# EAGLE design netSpeed (EAGLE 6.4)
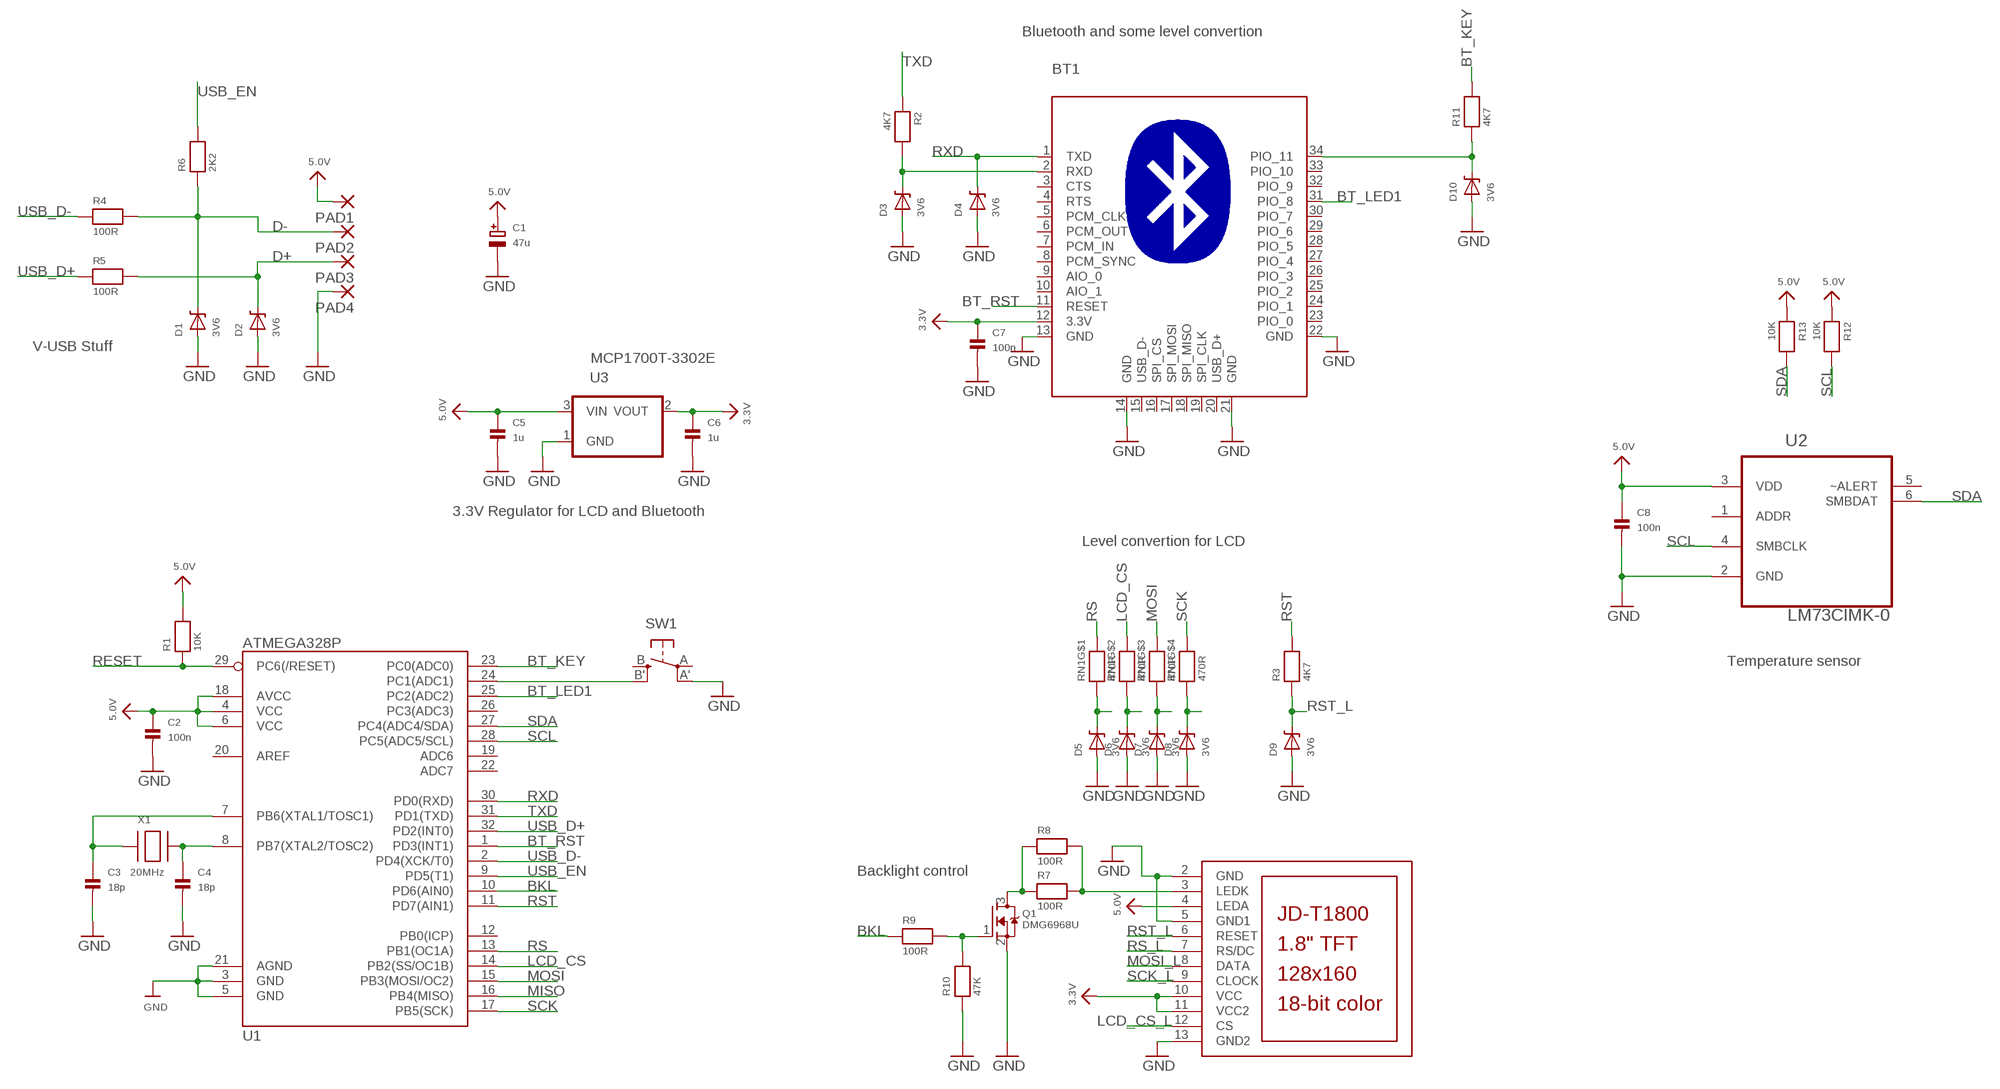
[diagram p0: schematic, sheet 1]

## Parts
BT1  BLUETOOTH_MODULE  [BLUETOOTH_MODULE]
C1  47u  CAP_ELECTROLYTICPANASONIC_C  [PANASONIC_C]
C2  100n  CAP_CERAMIC0805  [0805]
C3  18p  CAP_CERAMIC0805  [0805]
C4  18p  CAP_CERAMIC0805  [0805]
C5  1u  CAP_CERAMIC0805  [0805]
C6  1u  CAP_CERAMIC0805  [0805]
C7  100n  CAP_CERAMIC0805  [0805]
C8  100n  CAP_CERAMIC0805  [0805]
D1  3V6  DIODE-ZENERSOD-323  [SOD-323]
D2  3V6  DIODE-ZENERSOD-323  [SOD-323]
D3  3V6  DIODE-ZENERSOD-323  [SOD-323]
D4  3V6  DIODE-ZENERSOD-323  [SOD-323]
D5  3V6  DIODE-ZENERSOD-323  [SOD-323]
D6  3V6  DIODE-ZENERSOD-323  [SOD-323]
D7  3V6  DIODE-ZENERSOD-323  [SOD-323]
D8  3V6  DIODE-ZENERSOD-323  [SOD-323]
D9  3V6  DIODE-ZENERSOD-323  [SOD-323]
D10  3V6  DIODE-ZENERSOD-323  [SOD-323]
LCD1  JD-T1800  [JD-T1800]
PAD1  SMD2  [SMD1,27-2,54]
PAD2  SMD2  [SMD1,27-2,54]
PAD3  SMD2  [SMD1,27-2,54]
PAD4  SMD2  [SMD1,27-2,54]
Q1  DMG6968U  MOSFET-NWIDE  [SOT23-WIDE]
R1  10K  RESISTOR0805  [0805]
R2  4K7  RESISTOR0805  [0805]
R3  4K7  RESISTOR0805  [0805]
R4  100R  RESISTOR0805  [0805]
R5  100R  RESISTOR0805  [0805]
R6  2K2  RESISTOR0805  [0805]
R7  100R  RESISTOR0805  [0805]
R8  100R  RESISTOR0805  [0805]
R9  100R  RESISTOR0805  [0805]
R10  47K  RESISTOR0805  [0805]
R11  4K7  RESISTOR0805  [0805]
R12  10K  RESISTOR0805  [0805]
R13  10K  RESISTOR0805  [0805]
RN1  470R  RESISTOR_4PACK  [RESPACK_4X0603]
SW1  SPST_TACT  [TACT_SMD]
U1  ATMEGA328P  ATMEGA328_SMT  [TQFP32-08]
U2  LM73CIMK-0  [SOT95P285X100-6N]
U3  MCP1700T-3302E  MCP1700T-2502E/TTWIDE_PAD  [SOT-23]
X1  20MHz  XTALNX5032  [NX5032]

## Nets
3.3V: BT1.12(3.3V) C6.1 C7.1 LCD1.10(VCC) LCD1.11(VCC2) U3.2(VOUT)
5.0V: C1.+ C2.1 C5.1 C8.1 LCD1.4(LEDA) PAD1.1(P) R1.2 R12.1 R13.1 U1.4(VCC) U1.6(VCC) U1.18(AVCC) U2.3(VDD) U3.3(VIN)
BKL: R9.1 U1.10(PD6(AIN0))
BT_KEY: R11.2 U1.23(PC0(ADC0))
BT_KEY_L: BT1.34(PIO_11) D10.C R11.1
BT_LED1: BT1.31(PIO_8) U1.25(PC2(ADC2))
BT_RST: BT1.11(RESET) U1.1(PD3(INT1))
D+: D2.C PAD3.1(P) R5.2
D-: D1.C PAD2.1(P) R4.2 R6.1
GND: BT1.13(GND) BT1.14(GND) BT1.21(GND) BT1.22(GND) C1.- C2.2 C3.2 C4.2 C5.2 C6.2 C7.2 C8.2 D1.A D2.A D3.A D4.A D5.A D6.A D7.A D8.A D9.A D10.A LCD1.2(GND) LCD1.5(GND1) LCD1.13(GND2) PAD4.1(P) Q1.2(S) R10.1 SW1.A'(P1) U1.3(GND) U1.5(GND) U1.21(AGND) U2.2(GND) U3.1(GND)
LCD_CS: RN1.7 U1.14(PB2(SS/OC1B))
LCD_CS_L: D6.C LCD1.12(CS) RN1.2
MISO: U1.16(PB4(MISO))
MOSI: RN1.6 U1.15(PB3(MOSI/OC2))
MOSI_L: D7.C LCD1.8(DATA) RN1.3
N$2: SW1.B'(S1) U1.24(PC1(ADC1))
N$4: C3.1 U1.7(PB6(XTAL1/TOSC1)) X1.P$1
N$5: C4.1 U1.8(PB7(XTAL2/TOSC2)) X1.P$2
N$19: Q1.1(G) R9.2 R10.2
N$20: Q1.3(D) R7.1 R8.1
N$21: LCD1.3(LEDK) R7.2 R8.2
RESET: R1.1 U1.29(PC6(/RESET))
RS: RN1.8 U1.13(PB1(OC1A))
RS_L: D5.C LCD1.7(RS/DC) RN1.1
RST: R3.2 U1.11(PD7(AIN1))
RST_L: D9.C LCD1.6(RESET) R3.1
RXD: BT1.1(TXD) D4.C U1.30(PD0(RXD))
SCK: RN1.5 U1.17(PB5(SCK))
SCK_L: D8.C LCD1.9(CLOCK) RN1.4
SCL: R12.2 U1.28(PC5(ADC5/SCL)) U2.4(SMBCLK)
SDA: R13.2 U1.27(PC4(ADC4/SDA)) U2.6(SMBDAT)
TXD: R2.1 U1.31(PD1(TXD))
TXD_L: BT1.2(RXD) D3.C R2.2
USB_D+: R5.1 U1.32(PD2(INT0))
USB_D-: R4.1 U1.2(PD4(XCK/T0))
USB_EN: R6.2 U1.9(PD5(T1))
Unconnected: BT1.3(CTS) BT1.4(RTS) BT1.5(PCM_CLK) BT1.6(PCM_OUT) BT1.7(PCM_IN) BT1.8(PCM_SYNC) BT1.9(AIO_0) BT1.10(AIO_1) BT1.15(USB_D-) BT1.16(SPI_CS) BT1.17(SPI_MOSI) BT1.18(SPI_MISO) BT1.19(SPI_CLK) BT1.20(USB_D+) BT1.23(PIO_0) BT1.24(PIO_1) BT1.25(PIO_2) BT1.26(PIO_3) BT1.27(PIO_4) BT1.28(PIO_5) BT1.29(PIO_6) BT1.30(PIO_7) BT1.32(PIO_9) BT1.33(PIO_10) SW1.A(P) SW1.B(S) U1.12(PB0(ICP)) U1.19(ADC6) U1.20(AREF) U1.22(ADC7) U1.26(PC3(ADC3)) U2.1(ADDR) U2.5(~ALERT)

## Notes on the sheet
- Bluetooth and some level convertion
- V-USB Stuff
- 3.3V Regulator for LCD and Bluetooth
- Level convertion for LCD
- Temperature sensor
- Backlight control

## Library data of the parts
BT1 = microbuilder:BLUETOOTH_MODULE: BLUETOOTH MODULE
C1 = microbuilder:CAP_ELECTROLYTIC: Electrolytic Capacitors SMT PANASONIC_C - Size C Panasonic Electrolytic Aluminum Capacitor 47µF 16V 20% Electrolytic Capacitor [Digikey: PCE3890TR-ND] PANASONIC_D - Size D Panasonic Electrolytic Aluminum Capacitor 100µF 25V 20% Electrolytic Capacitor [Digikey: PCE3898TR-ND] PTH 3.5 mm grid, 8 mm diameter ... 3.5 mm grid, 10 mm diameter ...
C2-C8 = microbuilder:CAP_CERAMIC: Ceramic Capacitors 0402 - 0402 Surface Mount Capacitors 16pF 50V 5% [Digikey: 445-4899-2-ND] 18pF 50V 5% [Digikey: 490-1281-2-ND] 22pF 50V 5% [Digikey: 490-1283-2-ND] 68pF 50V 5% [Digikey: 490-1289-2-ND] 0.1uF 10V 10% [Digikey: 490-1318-2-ND] 1.0uF 6.3V 10% [Digikey: 490-1320-2-ND] 0603 - 0603 Surface Mount Capacitors 16 pF 50V 5% [Digikey: 445-5051-2-ND] 22 pF 50V [Digikey: PCC220ACVTR-ND] 33 pF 50V 5% [Digikey: 490-1415-1-ND] 56pF 50V 5% [Digikey: 490-1421-1-ND] 220pF 50V 5% [Digikey: 445-1285-1-ND] 680 pF 50V 2200 pF 50V 5% C0G [Digikey: 445-1297-1-ND] 5600 pF 100V 5% X7R [Digikey: 478-3711-1-ND] 0.1 µF 25V 10% [Digikey: PCC2277TR-ND] 0.22 µF 16V 10% X7R [Digikey: 445-1318-1-ND] 1.0 µF 25V 10% [Digikey: 445-5146-2-ND] 0603 - RF Specific 3pF 250V +/-0.1pF RF [Digikey: 712-1347-1-ND] 18 pF 250V 5% [Digikey: 478-3505-1-ND or 712-1322-1-ND] 56 pF 250V 5% C0G RF [Digikey: 490-4867-1-ND] 68 pF 250V RF [Digikey: 490-4868-1-ND] 0805 - 0805 Surface Mount Capacitors 220 pF 250V 2% RF Ceramic Capacitor [Digikey: 712-1398-1-ND] 1000 pF 50V 2% NP0 Ceramic Capacitor [Digikey: 478-3760-1-ND] 0.1 µF 25V 10% Ceramic Capacitor [Digikey: PCC1828TR-ND] 1.0 µF 16V 10% Ceramic Capacitor[Digikey: 490-1691-2-ND] 10.0 µF 10V 10% Ceramic Capacitor[Digikey: 709-1228-1-ND] 10.0 uF 16V 10% Ceramic Capacitor [Digikey: 478-5165-2-ND] 47 uF 6.3V 20% Ceramic Capacitor [Digikey: 587-1779-1-ND or 399-5506-1-ND] 1206 - 1206 Surface Mount Capacitors 47uF 10V 20% Ceramic Capacitor [Digikey: 490-5528-1-ND or 399-5508-1-ND or 445-6010-1-ND] 100uF 6.3V -20%, +80% Y5V Ceramic Capacitor (Digikey: 490-4512-1-ND, Mouser: 81-GRM31CF50J107ZE1L)
D1-D10 = zak:DIODE-ZENER
LCD1 = adafruit:JD-T1800
PAD1-PAD4 = wirepad:SMD2: SMD PAD
Q1 = microbuilder:MOSFET-N: N-Channel Mosfet LEGEND VDS: Voltage Drain-Source ID: Drain Current RDS(ON): Drain-Source On-State Resistance VGS(TH): Gate-Source Threshold Voltage CISS: Drain-Source Input Capacitance SOT-23 Name VDS ID RDS(ON) VGS(TH) CISS Order Number 2N7002E 60V 260mA 2.5 Ohm 2.5V @ 250uA 26.7pF @ 25V 2N7002ET1GOSTR-ND BSH103 30V 850mA 400 mOhm 400mV @ 1mA 83pF @ 24V BSH103,235-ND BSS138 60V 320mA 1.6 Ohm 1.5V @ 250uA 50pF @ 10V Mouser: 771-BSS138PW115 DMN2075U-7 20V 4.2A 38 mOhm 1V @ 250 uA 594.3pF @ 10V DMN2075U-7DICT-ND * BSS138 good choice for I2C level-shifting
R1-R13 = microbuilder:RESISTOR: Resistors 0402 - 0402 Surface Mount Package 22 Ohm 1% 1/16W [Digikey: 311-22.0LRTR-ND] 33 Ohm 5% 1/16W 1.0K 5% 1/16W 1.5K 5% 1/16W 2.0K 1% 1/16W 10.0K 1% 1/16W [Digikey: 311-10.0KLRTR-ND] 10.0K 5% 1/16W [Digikey: RMCF0402JT10K0TR-ND] 12.1K 1% 1/16W [Digikey: 311-22.0LRTR-ND] 100.0K 5% 1/16W 0603 - 0603 Surface Mount Package 0 Ohm 1/10 Watt 1% Resistor 15 Ohm 1/10 Watt 1% Resistor 33 Ohm 1/10 Watt 1% Resistor 49.9 Ohm 1/10 Watt 1% Resistor 100 Ohm 1/10 Watt 1% Resistor 150 Ohm 1/10 Watt 1% Resistor 240 Ohm 1/10 Watt 1% Resistor 390 Ohm 1/10 Watt 1% Resistor 560 Ohm 1/10 Watt 1% Resistor 680 Ohm 1/10 Watt 1% Resistor 750 Ohm 1/10 Watt 1% Resistor 1.0K Ohm 1/10 Watt 1% Resistor 1.5K Ohm 1/10 Watt 1% Resistor 2.0K Ohm 1/10 Watt 1% Resistor 2.2K Ohm 1/10 Watt 1% Resistor 3.3K Ohm 1/10 Watt 1% Resistor 4.7K Ohm 1/10 Watt 1% Resistor 10.0K Ohm 1/10 Watt 1% Resistor 12.0K Ohm 1/10 Watt 1% Resistor 12.1K Ohm 1/10 Watt 1% Resistor 20.0K Ohm 1/10 Watt 1% Resistor 33.0K Ohm 1/10 Watt 1% Resistor 100.0K Ohm 1/10 Watt 1% Resistor 0805 - 0805 Surface Mount Package 0 Ohm 1/8 Watt 1% Resistor 33 Ohm 1/8 Watt 1% Resistor 100 Ohm 1/8 Watt 1% Resistor 150 Ohm 1/8 Watt 1% Resistor 200 Ohm 1/8 Watt 1% Resistor 240 Ohm 1/8 Watt 1% Resistor 330 Ohm 1/8 Watt 1% Resistor 390 Ohm 1/8 Watt 1% Resistor 470 Ohm 1/8 Watt 1% Resistor 1.0K Ohm 1/8 Watt 1% Resistor 1.5K Ohm 1/8 Watt 1% Resistor 2.0K Ohm 1/8 Watt 1% Resistor 4.7K Ohm 1/8 Watt 1% Resistor 5.1K Ohm 1/8 Watt 1% Resistor 5.6K Ohm 1/8 Watt 1% Resistor 10.0K Ohm 1/8 Watt 1% Resistor 22.0K Ohm 1/8 Watt 1% Resistor 33.0K Ohm 1/8 Watt 1% Resistor 100K Ohm 1/8 Watt 1% Resistor 1206 - 1206 Surface Mount Package 2012 - 2010 Surface Mount Package 0.11 Ohm 1/2 Watt 1% Resistor - Digikey: RHM.11UCT-ND
RN1 = microbuilder:RESISTOR_4PACK: Resistor Packs (4 resistors) 4 x 0603 10K 1/16W - Digikey: YC164J-10KCT-ND
SW1 = zak:SPST_TACT
U1 = SparkFun-DigitalIC:ATMEGA328_SMT: 32-Pin Atmega328 part Commonly used on Arduino compatible boards Available in QFP and QFN packages TQFP is IC-09069 QFN is non-stock; PROD_ID: IC-09069
U2 = zak:LM73CIMK-0: Digital Temperature Sensor; MPN: LM73CIMK-0; OC_FARNELL: 1312598; OC_NEWARK: 69K2606; PACKAGE: SOT-23-6; SUPPLIER: National Semiconductor
U3 = zak:MCP1700T-2502E/TT: Low Quiescent Current LDO
X1 = adafruit:XTAL: Low cost SMT crystals, no capacitors included http://www.ladyada.net/library/eagle

## Board
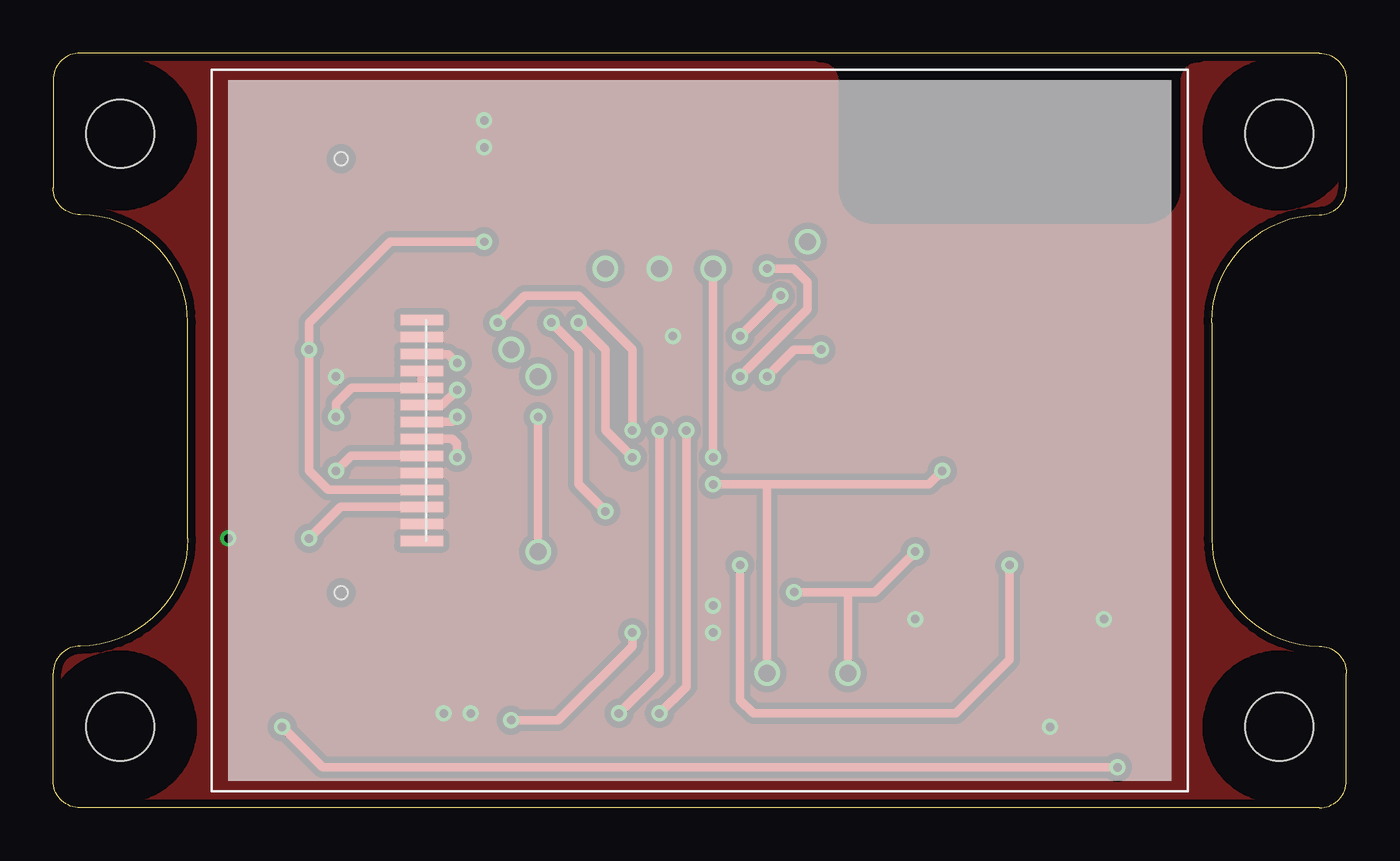
[diagram p1: board, top side]
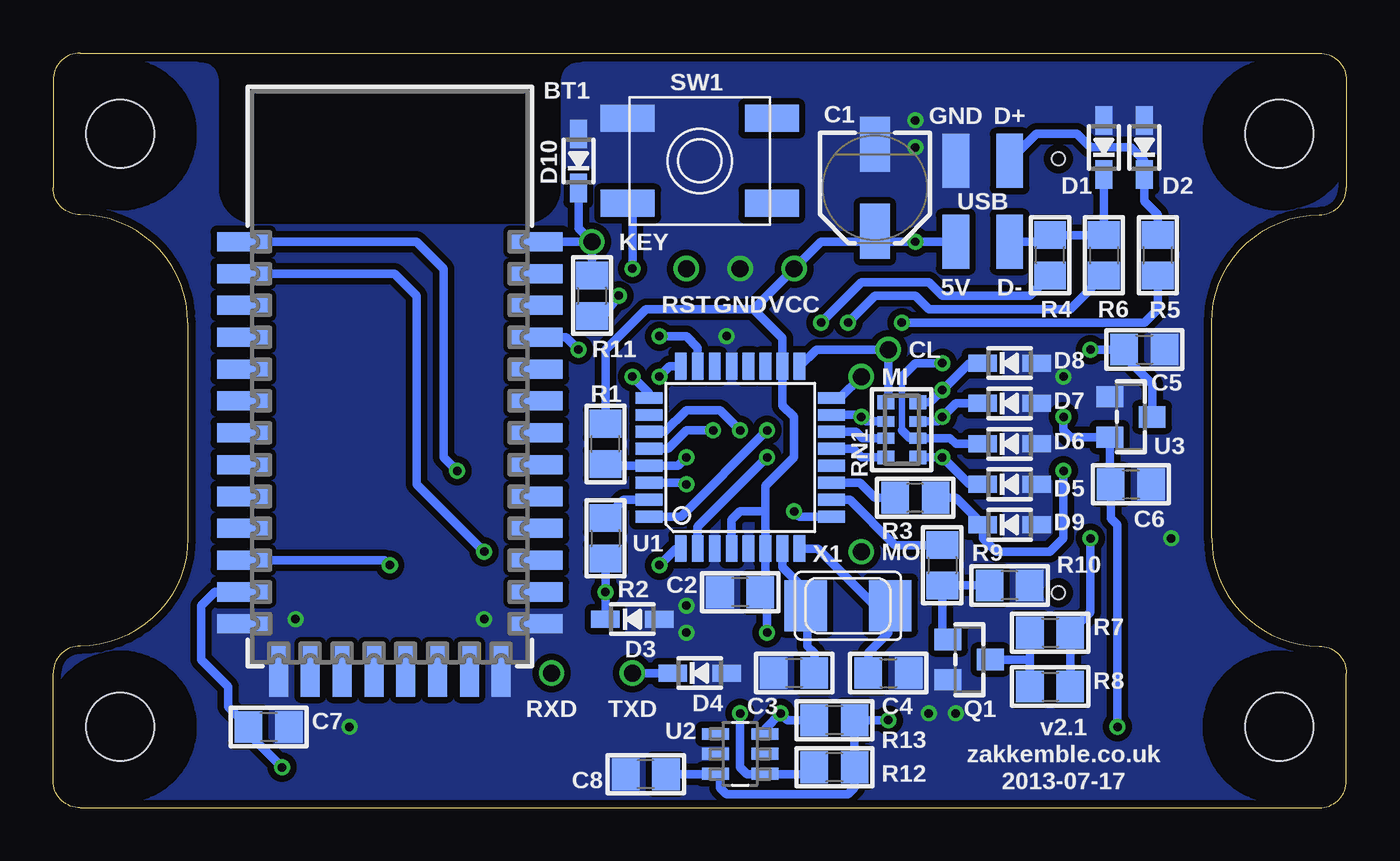
[diagram p2: board, bottom side, seen from below]

Size 60.96 x 35.56 mm. Coordinates in mm from the lower left corner, seen from the top.
Outline: 59.69,35.56 arc-90 60.96,34.29 60.96,29.21 arc-90 59.69,27.94 arc90 54.61,22.86 54.61,12.7 arc90 59.69,7.62 arc-90 60.96,6.35 60.96,1.27 arc-90 59.69,0 1.27,0 arc-90 0,1.27 0,6.35 arc-90 1.27,7.62 arc90 6.35,12.7 6.35,22.86 arc90 1.27,27.94 arc-90 0,29.21 0,34.29 arc-90 1.27,35.56 59.69,35.56
Copper layers (1*16): Top 0.0356mm / dielectric 1.5011mm / Bottom 0.0356mm
Design rules "default *": minimum track width 6mil, minimum drill 13mil, track to track 6mil, track to pad 6mil, pad to pad 6mil, via to via 6mil, smd to smd 6mil, copper to edge 15mil, drill to drill 6mil, minimum pad ring 7mil, minimum via ring 7mil, stop-mask expansion 4mil, vias tented up to drill 26mil, thermal gap 10mil
Holes 3.2 mm at 57.79,31.75 57.79,3.81 3.18,31.75 3.18,3.81
tRestrict: area 36.2,27.9 to 54,35.6; area 0,28.6 to 6.4,34.9; area 0,0.6 to 6.4,7; area 54.6,0.6 to 61,7; area 54.6,28.6 to 61,34.9
bRestrict: area 36.2,27.9 to 54,35.6; area 54.6,28.6 to 61,34.9; area 0,0.6 to 6.4,7; area 54.6,0.6 to 61,7; area 0,28.6 to 6.4,34.9

### Footprints (pad centres in the part's own frame; a part is rotated, then mirrored left to right if it is on the bottom)
BLUETOOTH_MODULE = smd 2.5 x 0.9: 1 -6.9,6.35; 2 -6.9,4.85; 3 -6.9,3.35; 4 -6.9,1.85; 5 -6.9,0.35; 6 -6.9,-1.15; 7 -6.9,-2.65; 8 -6.9,-4.15; 9 -6.9,-5.65; 10 -6.9,-7.15; 11 -6.9,-8.65; 12 -6.9,-10.15; 13 -6.9,-11.65; 22 6.9,-11.65; 23 6.9,-10.15; 24 6.9,-8.65; 25 6.9,-7.15; 26 6.9,-5.65; 27 6.9,-4.15; 28 6.9,-2.65; 29 6.9,-1.15; 30 6.9,0.35; 31 6.9,1.85; 32 6.9,3.35; 33 6.9,4.85; 34 6.9,6.35 | smd 0.9 x 2.5: 14 -5.25,-13.83; 15 -3.75,-13.83; 16 -2.25,-13.83; 17 -0.75,-13.83; 18 0.75,-13.83; 19 2.25,-13.83; 20 3.75,-13.83; 21 5.25,-13.83
PANASONIC_C = smd 2.6 x 1.4: + 2.05,0; - -2.05,0
0805 = smd 1.3 x 1.5: 1 -0.95,0; 2 0.95,0
SOD-323 = smd 1.35 x 0.8: A 1.27,0; C -1.27,0
JD-T1800 = smd 0.5 x 2: 1 5.2,-13.1; 2 4.4,-13.1; 3 3.6,-13.1; 4 2.8,-13.1; 5 2,-13.1; 6 1.2,-13.1; 7 0.4,-13.1; 8 -0.4,-13.1; 9 -1.2,-13.1; 10 -2,-13.1; 11 -2.8,-13.1; 12 -3.6,-13.1; 13 -4.4,-13.1; 14 -5.2,-13.1 | hole 0.6: -12.8,-16.9; 7.65,-16.9
SMD1,27-2,54 = smd 1.27 x 2.54: 1 0,0
SOT23-WIDE = smd 1 x 1.27: 1 -0.95,-1; 2 0.95,-1; 3 0,1
RESPACK_4X0603 = smd 0.65 x 0.8: 1 -1.3,-0.75; 4 1.3,-0.75; 5 1.3,0.75; 8 -1.3,0.75 | smd 0.5 x 0.8: 2 -0.4,-0.75; 3 0.4,-0.75; 6 0.4,0.75; 7 -0.4,0.75
TACT_SMD = smd 2.54 x 1.27: A -3.4,-2; A' 3.4,-2; B -3.4,2; B' 3.4,2
TQFP32-08 = smd 1.27 x 0.559: 1 -4.293,2.8; 2 -4.293,2; 3 -4.293,1.2; 4 -4.293,0.4; 5 -4.293,-0.4; 6 -4.293,-1.2; 7 -4.293,-2; 8 -4.293,-2.8; 17 4.293,-2.8; 18 4.293,-2; 19 4.293,-1.2; 20 4.293,-0.4; 21 4.293,0.4; 22 4.293,1.2; 23 4.293,2; 24 4.293,2.8 | smd 0.559 x 1.27: 9 -2.8,-4.293; 10 -2,-4.293; 11 -1.2,-4.293; 12 -0.4,-4.293; 13 0.4,-4.293; 14 1.2,-4.293; 15 2,-4.293; 16 2.8,-4.293; 25 2.8,4.293; 26 2,4.293; 27 1.2,4.293; 28 0.4,4.293; 29 -0.4,4.293; 30 -1.2,4.293; 31 -2,4.293; 32 -2.8,4.293
SOT95P285X100-6N = smd 1.27 x 0.559: 1 -1.168,0.94; 2 -1.168,0; 3 -1.168,-0.94; 4 1.168,-0.94; 5 1.168,0; 6 1.168,0.94
SOT-23 = smd 1 x 1.27: 1 -0.95,-1; 2 0.95,-1; 3 0,1
NX5032 = smd 2 x 2.4: P$1 2,0; P$2 -2,0

### Placement (x,y rotation side)
BT1  45.09,20.32 0 bottom
C1  22.23,29.21 270 bottom
C2  28.58,10.16 180 bottom
C3  26.04,6.35 180 bottom
C4  21.59,6.35 0 bottom
C5  9.53,21.59 0 bottom
C6  10.16,15.24 0 bottom
C7  50.8,3.81 0 bottom
C8  33.02,1.59 180 bottom
D1  11.43,31.11 90 bottom
D2  9.53,31.11 90 bottom
D3  33.66,8.89 0 bottom
D4  30.48,6.35 0 bottom
D5  15.88,15.24 0 bottom
D6  15.88,17.14 0 bottom
D7  15.88,19.05 0 bottom
D8  15.88,20.95 0 bottom
D9  15.88,13.33 0 bottom
D10  36.2,30.48 90 bottom
LCD1  30.48,17.78 270 top
PAD1  18.41,26.67 180 bottom
PAD2  15.88,26.67 0 bottom
PAD3  15.88,30.48 0 bottom
PAD4  18.41,30.48 0 bottom
Q1  17.78,6.99 270 bottom
R1  34.93,17.14 90 bottom
R2  34.93,12.7 270 bottom
R3  20.32,14.61 180 bottom
R4  13.97,26.04 90 bottom
R5  8.89,26.04 90 bottom
R6  11.43,26.04 270 bottom
R7  13.97,8.25 0 bottom
R8  13.97,5.72 0 bottom
R9  19.05,11.43 270 bottom
R10  15.88,10.48 180 bottom
R11  35.56,24.13 270 bottom
R12  24.13,1.91 180 bottom
R13  24.13,4.13 180 bottom
RN1  20.95,17.81 90 bottom
SW1  30.48,30.48 180 bottom
U1  28.58,16.51 90 bottom
U2  28.58,2.54 0 bottom
U3  10.16,18.41 270 bottom
X1  23.49,9.52 180 bottom

### Tracks (layer width: path | path; a pad name or v marks a point on that pad's centre or on a via)
3.3V  (via drill 0.4)
  Top 0.406: LCD1.11 LCD1.10 14.06,19.78 13.34,19.05 v13.34,18.41 | v10.8,3.81 12.7,1.91 v50.16,1.91
  Bottom 0.406: BT1.12 53.33,10.17 53.98,9.52 53.98,6.99 52.71,5.72 52.71,4.76 C7.1 51.43,3.5 51.43,3.17 v50.16,1.91 | v10.8,3.81 10.8,13.33 11.11,13.65 C6.1 11.16,15.29 U3.2 13.02,17.46 13.34,17.78 v13.34,18.41
5.0V  (via drill 0.4, 0.8)
  Top 0.406: v20.32,26.67 15.88,26.67 12.07,22.86 v12.07,21.59 12.07,15.88 12.96,14.98 LCD1.4 | v21.59,4.13 23.81,4.13 27.3,7.62 v27.3,8.25
  Bottom 0.406: U1.4 28.98,13.57 28.58,13.97 27.38,13.97 | R1.2 34.93,21.59 33.02,23.49 27.94,23.49 | 27.94,23.49 26.58,22.13 U1.18 26.58,18.95 26.04,18.41 26.04,16.51 27.38,15.17 27.38,13.97 | PAD1.1 v20.32,26.67 21.73,26.67 C1.+ 22.72,26.67 24.77,26.67 v26.04,25.4 27.94,23.49 | v12.07,21.59 C5.1 10.48,21.27 9.16,19.95 U3.3 | 27.38,13.97 U1.6 27.38,10.41 C2.1 27.3,9.84 v27.3,8.25 | C8.1 29.76,1.59 U2.3 29.53,1.38 29.53,0.95 29.21,0.64 23.49,0.64 23.18,0.95 R12.1 R13.1 v21.59,4.13
BKL
  Bottom 0.406: U1.10 23.4,14.51 21.27,12.38 R9.1
BT_KEY  (via drill 0.4)
  Top 0.406: v32.38,22.22 v34.29,24.13
  Bottom 0.406: U1.23 30.58,21.68 31.12,22.22 v32.38,22.22 | v34.29,24.13 35.24,22.86 R11.2
BT_KEY_L  (via drill 0.8)
  Bottom 0.406: v35.56,26.67 BT1.34 | D10.C 36.2,27.3 v35.56,26.67 | R11.1 v35.56,26.67
BT_LED1  (via drill 0.4)
  Top 0.406: v33.66,20.32 34.93,21.59 v36.2,21.59
  Bottom 0.406: U1.25 32.87,19.53 v33.66,20.32 | BT1.31 36.77,22.17 v36.2,21.59
BT_RST  (via drill 0.4)
  Top 0.406: v32.38,11.43 32.38,5.08 33.02,4.44 42.55,4.44 45.09,6.99 v45.09,11.43
  Bottom 0.406: U1.1 31.6,12.22 v32.38,11.43 | v45.09,11.43 45.33,11.67 BT1.11
D+
  Bottom 0.406: PAD3.1 14.61,31.75 12.7,31.75 12.07,31.11 10.16,31.11 9.53,30.48 D2.C 9.53,28.57 8.89,27.94 R5.2
D-
  Bottom 0.406: PAD2.1 14.29,26.67 R4.2 R6.1 D1.C
GND  (via drill 0.4, 0.8)
  other vias: 29.21,22.22 31.12,8.25 46.99,3.81 20.32,32.39 28.58,25.4 8.26,12.7 13.34,20.32 19.69,4.44 18.41,4.44 20.32,31.11 31.12,9.52 40.64,8.89 49.53,8.89
  pour Top (isolate 0.305, no thermals): 60.96,35.56 60.96,0 0,0 0,35.56
  pour Bottom (isolate 0.305, no thermals): 60.96,35.56 60.96,0 0,0 0,35.56
LCD_CS
  Bottom 0.406: U1.14 23.11,17.71 22.81,17.41 RN1.7
LCD_CS_L  (via drill 0.4)
  Top 0.406: LCD1.12 18.62,21.38 v19.05,20.95
  Bottom 0.305: 20.95,20.32 20.95,17.78
  Bottom 0.406: D6.C 18.41,17.14 18.68,17.41 RN1.2 20.59,17.41 20.95,17.78 | v19.05,20.95 20.32,20.95 20.95,20.32
MISO  (via drill 0.8)
  Bottom 0.406: U1.16 23.87,19.31 v22.86,20.32
MOSI  (via drill 0.4, 0.8)
  Top 0.406: v22.86,12.06 v22.86,18.41
  Bottom 0.406: RN1.6 22.66,18.21 v22.86,18.41 22.95,18.51 U1.15
MOSI_L  (via drill 0.4)
  Top 0.406: v19.05,18.41 18.81,18.18 LCD1.8
  Bottom 0.406: RN1.3 19.26,18.21 v19.05,18.41 18.41,19.05 D7.C
N$2  (via drill 0.4)
  Top 0.406: v33.66,25.4 34.93,25.4 35.56,24.76 35.56,23.49 v32.38,20.32
  Bottom 0.406: v33.66,25.4 33.66,28.25 SW1.B' | U1.24 31.9,20.8 v32.38,20.32
N$4
  Bottom 0.406: U1.7 26.58,11.33 25.4,10.16 25.4,9.62 X1.P$1 25.4,9.43 25.4,7.62 25.09,7.31 C3.1
N$5
  Bottom 0.406: U1.8 24.92,12.22 22.23,9.52 X1.P$2 21.59,9.43 21.59,8.25 22.54,7.31 C4.1
N$19
  Bottom 0.406: Q1.1 19.05,7.93 R9.2 R10.2
N$20
  Bottom 0.406: R7.1 14.92,6.99 | 14.92,6.99 R8.1 | Q1.3 14.92,6.99
N$21  (via drill 0.4)
  Top 0.406: LCD1.3 13.55,14.18 v12.07,12.7
  Bottom 0.406: R8.2 R7.2 12.07,9.21 v12.07,12.7
RESET  (via drill 0.4, 0.8)
  Top 0.406: v31.12,16.51 v31.12,25.4
  Bottom 0.406: R1.1 34.84,16.11 U1.29 31.52,16.11 v31.12,16.51
RS
  Bottom 0.406: U1.13 23.26,16.91 22.86,16.51 RN1.8
RS_L  (via drill 0.4)
  Top 0.406: v19.05,16.51 19.05,17.14 18.81,17.38 LCD1.7
  Bottom 0.406: RN1.1 v19.05,16.51 17.78,15.24 D5.C
RST
  Bottom 0.406: U1.11 22.93,15.31 22.23,14.61 R3.2
RST_L  (via drill 0.4)
  Top 0.406: LCD1.6 14.04,16.58 v13.34,15.88
  Bottom 0.406: R3.1 18.41,14.61 D9.C 17.15,12.7 16.51,12.06 13.97,12.06 13.34,12.7 v13.34,15.88
RXD  (via drill 0.4, 0.8)
  Top 0.406: 33.66,15.24 41.27,15.24 v41.91,15.88 | 33.66,15.24 v31.12,15.24 | v33.66,6.35 33.66,15.24
  Bottom 0.406: BT1.1 43.81,26.67 42.55,25.4 42.55,16.51 v41.91,15.88 | v31.12,15.24 31.19,15.31 U1.30 | D4.C v33.66,6.35
SCK  (via drill 0.8)
  Bottom 0.406: RN1.5 21.59,19.11 v21.59,21.59 24.99,21.59 U1.17 25.72,20.86
SCK_L  (via drill 0.4)
  Top 0.406: LCD1.9 18.34,18.98 v19.05,19.68
  Bottom 0.406: RN1.4 19.62,19.11 v19.05,19.68 17.78,20.95 D8.C
SCL  (via drill 0.4)
  Top 0.406: v29.84,17.78 29.84,5.72 v28.58,4.44
  Bottom 0.406: R12.2 25.4,1.59 27.39,1.59 U2.4 27.42,1.59 28.26,1.59 28.58,1.91 v28.58,4.44 | U1.28 31.98,16.91 31.12,17.78 v29.84,17.78
SDA  (via drill 0.4)
  Top 0.406: v26.67,4.44 28.58,6.35 v28.58,17.78
  Bottom 0.406: U1.27 32.14,17.71 31.12,18.73 29.53,18.73 v28.58,17.78 | R13.2 26.35,4.13 v26.67,4.44 27.41,3.71 U2.6
TXD
  Bottom 0.406: U1.31 34.06,14.51 R2.1
TXD_L  (via drill 0.4, 0.8)
  Top 0.406: v34.93,10.16 37.47,10.16 | 37.47,10.16 38.73,10.16 v40.64,12.06 | v37.47,6.35 37.47,10.16
  Bottom 0.406: BT1.2 44.86,25.17 43.81,24.13 43.81,15.24 v40.64,12.06 | R2.2 v34.93,10.16 D3.C
USB_D+  (via drill 0.4)
  Top 0.406: v20.95,22.86 22.23,24.13 24.77,24.13 27.3,21.59 v27.3,17.78
  Bottom 0.406: v27.3,17.78 31.38,13.71 U1.32 | v20.95,22.86 9.53,22.86 8.89,23.49 R5.1
USB_D-  (via drill 0.4)
  Top 0.406: v24.77,22.86 26.04,21.59 26.04,17.78 v27.3,16.51
  Bottom 0.406: U1.2 30.58,13.24 v27.3,16.51 | v24.77,22.86 22.86,24.76 19.69,24.76 19.05,24.13 14.93,24.13 R4.1
USB_EN  (via drill 0.4)
  Top 0.406: v23.49,22.86 24.77,21.59 24.77,15.24 v26.04,13.97
  Bottom 0.406: U1.9 25.77,13.71 v26.04,13.97 | R6.2 13.02,23.49 19.69,23.49 20.32,24.13 22.23,24.13 v23.49,22.86

### Text on the board
bNames: D+ | GND | USB | KEY | D- | 5V | VCC | GND | RST | CL | MI | MO | TXD | RXD | v2.1 | zakkemble.co.uk | 2013-07-17
bStop: Bluetooth Net Monitor